# Altium schematic sheet EEM_FMC_Carrier.schdoc: Phaser
size 420 x 297 mm; EDA_Number: ARTIQ; Projet: ARTIQ/SINARA; Author: G.Kasprowicz; CompanyName: WUT ISE; DrawnBy: G.Kasprowicz; Organization: WUT ISE; Address1: PW ISE; Address2: Nowowiejska 15/19 00-665 Warsaw; Address3: gkasprow@gmail.com; DocumentNumber: 1; Revision: 2; SheetNumber: 1; SheetTotal: 18; ModifiedBy: -; CheckedDate: -; Title2: Top; DivGrp: WUT ISE; Designer: G.Kasprowicz; ModifiedDate: -; ProjectName: Sensor Box
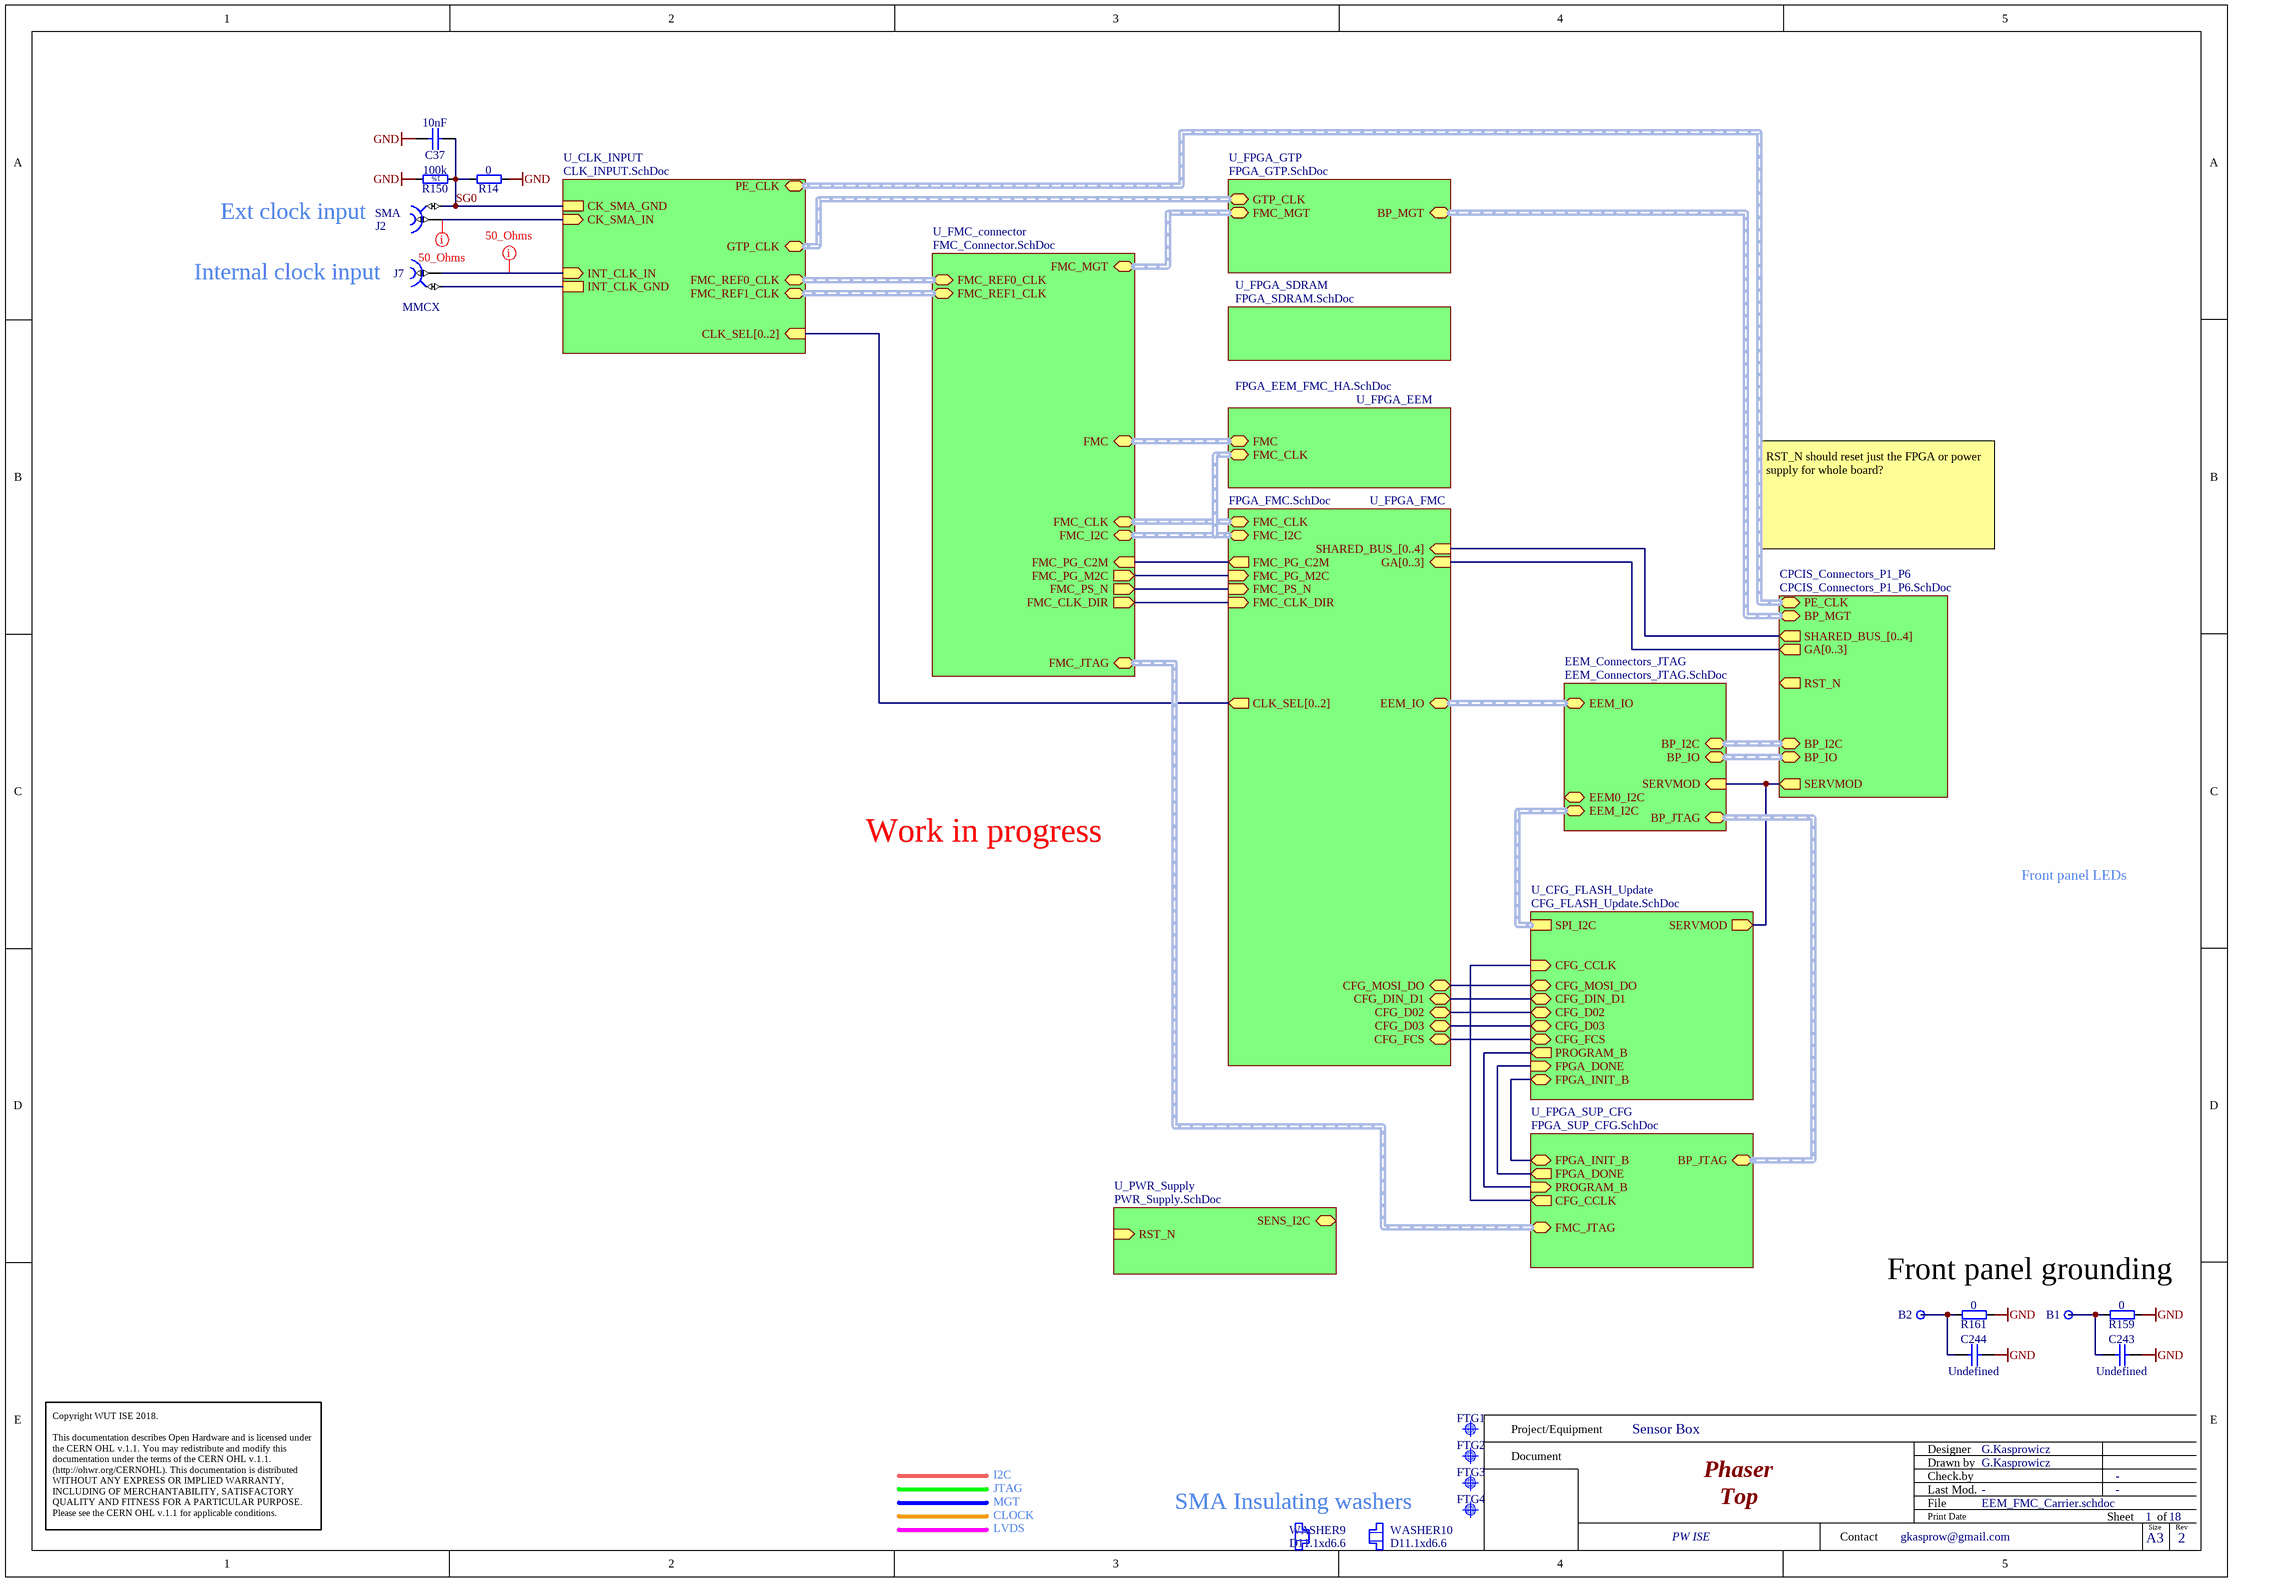
[diagram p0: EEM_FMC_Carrier.schdoc]

## Parts
B1  Plated Hole  [MTG270_500]  (value not drawn)
B2  Plated Hole  [MTG270_500]  (value not drawn)
C37  10nF  [CAPC1005X55N]
C243  Undefined  [CAPC2012X135N]
C244  Undefined  [CAPC2012X135N]
FTG1  Use only in PCB  [FIDUCIAL_TOP_C100-200]  (value not drawn)
FTG2  Use only in PCB  [FIDUCIAL_TOP_S100-200]  (value not drawn)
FTG3  Use only in PCB  [FIDUCIAL_TOP_S100-200]  (value not drawn)
FTG4  Use only in PCB  [FIDUCIAL_TOP_S100-200]  (value not drawn)
J2  SMA  [AMPHENOL_132203-14]
J7  MMCX  [SAMTEC_MMCX-J-P-H-ST-TH1]
R14  0  [RESC1608X55N]
R150  100k  [RESC1005X40N]
R159  0  [RESC1608X55N]
R161  0  [RESC1608X55N]
WASHER9  D11.1xd6.6  [Keystone_7687]
WASHER10  D11.1xd6.6  [Keystone_7687]

## Sub-sheets
CPCIS_Connectors_P1_P6 = CPCIS_Connectors_P1_P6.SchDoc: BP_I2C (harness I2C), SERVMOD (out), RST_N (out), PE_CLK (harness CLK_DIFF), BP_MGT (harness MGT), GA[0..3] (out), BP_IO (harness EEM_LVDS), SHARED_BUS_[0..4] (out)
EEM_Connectors_JTAG = EEM_Connectors_JTAG.SchDoc: BP_JTAG (harness JTAG5), EEM0_I2C (harness I2C), EEM_IO (harness EEM_LVDS), BP_IO (harness EEM_LVDS), EEM_I2C (harness I2C), BP_I2C (harness I2C), SERVMOD (in)
U_CFG_FLASH_Update = CFG_FLASH_Update.SchDoc: SPI_I2C (harness I2C), CFG_MOSI_DO (bidir), CFG_DIN_D1 (bidir), CFG_D02 (bidir), CFG_D03 (bidir), CFG_FCS (bidir), CFG_CCLK (in), FPGA_DONE (in), FPGA_INIT_B (bidir), PROGRAM_B (out), SERVMOD (out)
U_CLK_INPUT = CLK_INPUT.SchDoc: CK_SMA_IN (in), INT_CLK_IN (in), CK_SMA_GND, INT_CLK_GND, PE_CLK (harness CLK_DIFF), FMC_REF1_CLK (harness CLK_DIFF), FMC_REF0_CLK (harness CLK_DIFF), GTP_CLK (harness CLK_DIFF), CLK_SEL[0..2] (in)
U_FMC_connector = FMC_Connector.SchDoc: FMC_REF1_CLK (harness CLK_DIFF), FMC_REF0_CLK (harness CLK_DIFF), FMC_CLK (harness FMC_CLK), FMC_PG_M2C (out), FMC_I2C (harness I2C), FMC_MGT (harness FMC_MGT), FMC_JTAG (harness JTAG5), FMC (harness FMC), FMC_PS_N (out), FMC_PG_C2M (in), FMC_CLK_DIR (out)
U_FPGA_EEM = FPGA_EEM_FMC_HA.SchDoc: FMC (harness FMC), FMC_CLK (harness FMC_CLK)
U_FPGA_FMC = FPGA_FMC.SchDoc: CFG_DIN_D1 (bidir), CFG_FCS (bidir), CFG_MOSI_DO (bidir), CFG_D02 (bidir), CFG_D03 (bidir), FMC_CLK_DIR (in), FMC_CLK (harness FMC_CLK), FMC_I2C (harness I2C), FMC_PS_N (in), FMC_PG_C2M (out), FMC_PG_M2C (in), CLK_SEL[0..2] (out), EEM_IO (harness EEM_LVDS), SHARED_BUS_[0..4] (in), GA[0..3] (in)
U_FPGA_GTP = FPGA_GTP.SchDoc: FMC_MGT (harness FMC_MGT), BP_MGT (harness MGT), GTP_CLK (harness CLK_DIFF)
U_FPGA_SDRAM = FPGA_SDRAM.SchDoc: no entries
U_FPGA_SUP_CFG = FPGA_SUP_CFG.SchDoc: FPGA_INIT_B (bidir), FPGA_DONE (out), CFG_CCLK (out), PROGRAM_B (in), FMC_JTAG (harness JTAG5), BP_JTAG (harness JTAG5)
U_PWR_Supply = PWR_Supply.SchDoc: SENS_I2C (harness I2C), RST_N (in)

## Nets
GND: C37.2 C243.2 C244.2 R14.1 R150.1 R159.1 R161.1
SG0: C37.1 J2.2 R14.2 R150.2 ; sheet U_CLK_INPUT/CK_SMA_GND
NetB1_1: B1.1 C243.1 R159.2
NetB2_1: B2.1 C244.1 R161.2
NetJ2_1: J2.1 ; sheet U_CLK_INPUT/CK_SMA_IN
NetJ7_1: J7.1 ; sheet U_CLK_INPUT/INT_CLK_IN
NetJ7_2: J7.2 ; sheet U_CLK_INPUT/INT_CLK_GND
(unnamed): sheet U_FPGA_FMC/CFG_DIN_D1, sheet U_CFG_FLASH_Update/CFG_DIN_D1
(unnamed): sheet U_FPGA_FMC/CFG_FCS, sheet U_CFG_FLASH_Update/CFG_FCS
(unnamed): sheet U_FPGA_FMC/CFG_MOSI_DO, sheet U_CFG_FLASH_Update/CFG_MOSI_DO
(unnamed): sheet U_FPGA_FMC/CFG_D02, sheet U_CFG_FLASH_Update/CFG_D02
(unnamed): sheet U_FPGA_FMC/CFG_D03, sheet U_CFG_FLASH_Update/CFG_D03
(unnamed): sheet U_FPGA_FMC/FMC_CLK_DIR, sheet U_FMC_connector/FMC_CLK_DIR
(unnamed): sheet U_FPGA_FMC/FMC_PS_N, sheet U_FMC_connector/FMC_PS_N
(unnamed): sheet U_FPGA_FMC/FMC_PG_C2M, sheet U_FMC_connector/FMC_PG_C2M
(unnamed): sheet U_FPGA_FMC/FMC_PG_M2C, sheet U_FMC_connector/FMC_PG_M2C
(unnamed): sheet U_FPGA_SUP_CFG/FPGA_INIT_B, sheet U_CFG_FLASH_Update/FPGA_INIT_B
(unnamed): sheet U_FPGA_SUP_CFG/FPGA_DONE, sheet U_CFG_FLASH_Update/FPGA_DONE
(unnamed): sheet U_FPGA_SUP_CFG/CFG_CCLK, sheet U_CFG_FLASH_Update/CFG_CCLK
(unnamed): sheet U_FPGA_SUP_CFG/PROGRAM_B, sheet U_CFG_FLASH_Update/PROGRAM_B
(unnamed): sheet U_CFG_FLASH_Update/SERVMOD, sheet CPCIS_Connectors_P1_P6/SERVMOD, sheet EEM_Connectors_JTAG/SERVMOD

## Buses and harness runs
bus sheet CPCIS_Connectors_P1_P6/GA[0..3] = sheet U_FPGA_FMC/GA[0..3]
bus sheet CPCIS_Connectors_P1_P6/SHARED_BUS_[0..4] = sheet U_FPGA_FMC/SHARED_BUS_[0..4]
bus sheet U_CLK_INPUT/CLK_SEL[0..2] = sheet U_FPGA_FMC/CLK_SEL[0..2]
harness sheet CPCIS_Connectors_P1_P6/BP_I2C = sheet EEM_Connectors_JTAG/BP_I2C
harness sheet CPCIS_Connectors_P1_P6/BP_IO = sheet EEM_Connectors_JTAG/BP_IO
harness sheet CPCIS_Connectors_P1_P6/BP_MGT = sheet U_FPGA_GTP/BP_MGT
harness sheet CPCIS_Connectors_P1_P6/PE_CLK = sheet U_CLK_INPUT/PE_CLK
harness sheet EEM_Connectors_JTAG/BP_JTAG = sheet U_FPGA_SUP_CFG/BP_JTAG
harness sheet EEM_Connectors_JTAG/EEM_I2C = sheet U_CFG_FLASH_Update/SPI_I2C
harness sheet EEM_Connectors_JTAG/EEM_IO = sheet U_FPGA_FMC/EEM_IO
harness sheet U_CLK_INPUT/FMC_REF0_CLK = sheet U_FMC_connector/FMC_REF0_CLK
harness sheet U_CLK_INPUT/FMC_REF1_CLK = sheet U_FMC_connector/FMC_REF1_CLK
harness sheet U_CLK_INPUT/GTP_CLK = sheet U_FPGA_GTP/GTP_CLK
harness sheet U_FMC_connector/FMC = sheet U_FPGA_EEM/FMC
harness sheet U_FMC_connector/FMC_CLK = sheet U_FPGA_FMC/FMC_CLK
harness sheet U_FMC_connector/FMC_I2C = sheet U_FPGA_EEM/FMC_CLK = sheet U_FPGA_FMC/FMC_I2C
harness sheet U_FMC_connector/FMC_JTAG = sheet U_FPGA_SUP_CFG/FMC_JTAG
harness sheet U_FMC_connector/FMC_MGT = sheet U_FPGA_GTP/FMC_MGT

## Layout directives
net class 50_Ohms: NetJ2_1, NetJ7_1

## Notes on the sheet
- (near J2) Ext clock input
- (near J7) Internal clock input
- RST_N should reset just the FPGA or power supply for whole board?
- Work in progress
- Front panel LEDs
- Front panel grounding
- I2C
- JTAG
- MGT
- CLOCK
- LVDS
- SMA Insulating washers
- Project/Equipment
- Document
- Designer
- Drawn by
- Check.by
- Copyright WUT ISE 2018.
  This documentation describes Open Hardware and is licensed under the CERN OHL v.1.1. You may redistribute and modify this documentation under the terms of the CERN OHL v.1.1. (http://ohwr.org/CERNOHL). This documentation is distributed WITHOUT ANY EXPRESS OR IMPLIED WARRANTY, INCLUDING OF MERCHANTABILITY, SATISFACTORY QUALITY AND FITNESS FOR A PARTICULAR PURPOSE. Please see the CERN OHL v.1.1 for applicable conditions.
- Contact
- File
- Last Mod.
- Print Date
- Sheet
- Size
- A3
- of
- Rev
- (in symbol R0402_100K_1%_0.0625W_100PPM) 1%

## Library data of the parts
B1 B2 = PLATED_HOLE2.7_PAD5.0: Single Terminal Socket; Part Description: Plated Through Hole: Hole Dia.=2.7mm Pad Dia.=5.0mm; Mounted: No; Part Number: PLATED_HOLE2.7_PAD5.0; Component Kind: Standard (No BOM); Component Type: Standard (No BOM); Pin Count: 1; Family: Plated Hole; Socket: No; SMD: No; Sense: No; Status: None; ComponentHeight: 0mm; HelpURL: Undefined; Author: CERN DEM JMW; CreateDate: 27.09.2011; LatestRevisionDate: 27.09.2011; PackageDescription: Plated Through Hole: Hole Dia.=2.7mm Pad Dia.=5.0mm
C37 = CC0402_10NF_16V_10%_X7R: Non-polarised capacitor; Part Description: SMD Multilayer Chip Ceramic Capacitor; Manufacturer: GENERIC; Manufacturer1 Part Number: 223878715636; Voltage: 16V; TC: X7R; Tolerance: ±10%; Part Number: CC0402_10NF_16V_10%_X7R; Component Kind: Standard; Component Type: Standard; Pin Count: 2; Value: 10nF; Status: Not Recommended; Manufacturer Part Number: CC0402_10NF_16V_10%_X7R; Case: 0402; Mounted: Yes; Socket: No; SMD: Yes; Sense: No; Manufacturer1 Example: PHYCOMP; Manufacturer1 ComponentHeight: 0.55mm; HelpURL: \\cern.ch\dfs\Applications\Altium\Datasheets\CC0402_X7R_PHYCOMP.pdf; Author: CERN DEM JLC; CreateDate: 2007-12-03; LatestRevisionDate: 2007-12-03
C243 C244 = CC0805_NO-VALUE: Non-polarised capacitor; Part Description: Reserved Footprint For 0805(2012) Chip Ceramic Capacitor; Mounted: No; Part Number: CC0805_NO-VALUE; Component Kind: Standard; Component Type: Standard; Pin Count: 2; Value: Undefined; Status: None; Manufacturer: Undefined; Manufacturer Part Number: CC0805_NO-VALUE; Case: 0805; Socket: No; SMD: Yes; Sense: No; Manufacturer1 ComponentHeight: 1.35mm; HelpURL: Undefined; Author: CERN DEM JLC; CreateDate: 10.12.2008; LatestRevisionDate: 11.09.2013
FTG1 = FIDUCIAL_TARGET_C100-200: Fiducial Target; Part Description: Round Fiducial Target, Top Layer, 1.0mm, Top Solder 2.0mm, Keepout =2.0mm; Mounted: No; Part Number: FIDUCIAL_TARGET_C100-200; Component Kind: Standard (No BOM); Component Type: Standard (No BOM); Pin Count: 1; Family: Fiducial; Socket: No; SMD: Yes; Sense: No; Status: None; ComponentHeight: 0mm; HelpURL: Undefined; Author: CERN DEM JLC; CreateDate: 09.02.2010; LatestRevisionDate: 04.04.2012; PackageDescription: Round Fiducial Target, Top Layer, 1.0mm, Top Solder 2.0mm, Keepout =2.0mm
FTG2-FTG4 = FIDUCIAL_TARGET_S100-200: Fiducial Target; Part Description: Square Fiducial Target, Top Layer, 1.0mm, Top Solder 2.0mm, Keepout =2.0mm; Mounted: No; Part Number: FIDUCIAL_TARGET_S100-200; Component Kind: Standard (No BOM); Component Type: Standard (No BOM); Pin Count: 1; Family: Fiducial; Socket: No; SMD: Yes; Sense: No; Status: None; ComponentHeight: 0mm; HelpURL: Undefined; Author: CERN DEM JLC; CreateDate: 09.02.2010; LatestRevisionDate: 04.04.2012; PackageDescription: Square Fiducial Target, Top Layer, 1.0mm, Top Solder 2.0mm, Keepout =2.0mm
J2 = CON_SMA_AMP_132203-14: 50 Ohm Through Hole SMA Right Angle PCB Jack; Manufacturer: AMPHENOL; PressFit: No; Part Number: AMPHENOL_132203-14; Component Kind: Standard; Component Type: Standard; Pin Count: 5; Family: SMA; Mounted: Yes; Socket: No; SMD: No; Sense: No; Status: None; Part Description: 50 Ohm Through Hole SMA Right Angle PCB Jack; Manufacturer Part Number: 132203-14; ComponentHeight: 10.4mm; HelpURL: \\cern.ch\dfs\Applications\Altium\Datasheets\AMPHENOL_132203-16.pdf; Author: GK; CreateDate: 13.05.2019; LatestRevisionDate: 13.05.2019
J7 = SAMTEC_MMCX-J-P-H-ST-TH1: Part Description: Straight Through-hole 50 Ohm Micro Mini RF Jack, MMCX Series; Manufacturer: SAMTEC; PressFit: No; Part Number: SAMTEC_MMCX-J-P-H-ST-TH1; Component Kind: Standard; Component Type: Standard; Pin Count: 2; Mounted: Yes; Socket: No; Sense: No; SMD: No; Status: None; Manufacturer Part Number: MMCX-J-P-H-ST-TH1; ComponentHeight: 4.35mm; HelpURL: \\cern.ch\dfs\Applications\Altium\Datasheets\SAMTEC_MMCX-J-P-H-ST-TH1.pdf; Author: CERN DEM JLC; CreateDate: 05.12.2012; LatestRevisionDate: 05.12.2012
R14 R159 R161 = R0603_0R_JUMPER: Resistor; Part Description: 1A (0.05R Max DC Resistance) Zero Ohm Jumper; Manufacturer: GENERIC; Manufacturer1 Part Number: NRC06Z0; PressFit: No; Part Number: R0603_0R_JUMPER; Component Kind: Standard; Component Type: Standard; Pin Count: 2; Value: 0; Status: Preferred; Manufacturer Part Number: R0603_0R_JUMPER; Case: 0603; Mounted: Yes; Sense: No; Socket: No; SMD: Yes; Manufacturer1 Example: NIC COMPONENT; Manufacturer1 ComponentHeight: 0.55mm; HelpURL: \\cern.ch\dfs\Applications\Altium\Datasheets\R0603_NIC_NRC.pdf; Author: CERN DEM JLC; CreateDate: 03.12.2007; LatestRevisionDate: 13.03.2008
R150 = R0402_100K_1%_0.0625W_100PPM: Resistor - 1%; Part Description: General Purpose Thick Film Chip Resistor; Manufacturer: GENERIC; Manufacturer1 Part Number: 232270671004L; PressFit: No; TC: ±100ppm/°C; Part Number: R0402_100K_1%_0.0625W_100PPM; Component Kind: Standard; Component Type: Standard; Pin Count: 2; Value: 100k; Status: Not Recommended; Manufacturer Part Number: R0402_100K_1%_0.0625W_100PPM; Case: 0402; Mounted: Yes; Sense: No; Socket: No; SMD: Yes; Manufacturer1 Example: YAGEO PHYCOMP; Manufacturer1 ComponentHeight: 0.4mm; HelpURL: \\cern.ch\dfs\Applications\Altium\Datasheets\R0402_Phycomp_RC0402.pdf; Author: CERN DEM JLC; CreateDate: 03.12.2007; LatestRevisionDate: 17.10.2012; Power: 0.0625W; Tolerance: ±1%
WASHER9 WASHER10 = Keystone_7687: SMA_Shoulder Washer; Part Number: custom 3D; Part Description: Polyphenylene Sulfide PPS Shoulder Washer; PressFit: No; Component Kind: Standard; Component Type: Mechanical; Footprint: custom 3D; Pin Count: 0; PackageDescription: Polyphenylene Sulfide PPS Shoulder Washer; Mounted: Yes; Socket: No; SMD: No; Sense: No; Status: None; Value: D11.1xd6.6; Manufacturer: custom 3D; Manufacturer Part Number: custom 3D; ComponentHeight: 1.91mm; HelpURL: \\cern.ch\dfs\Applications\Altium\Datasheets\AAVID-THERMALLOY_7721-7PPSG.pdf; Author: GK; CreateDate: 28.01.2016; LatestRevisionDate: 28.01.2016